# Altium project Controller_Board.PrjPcb
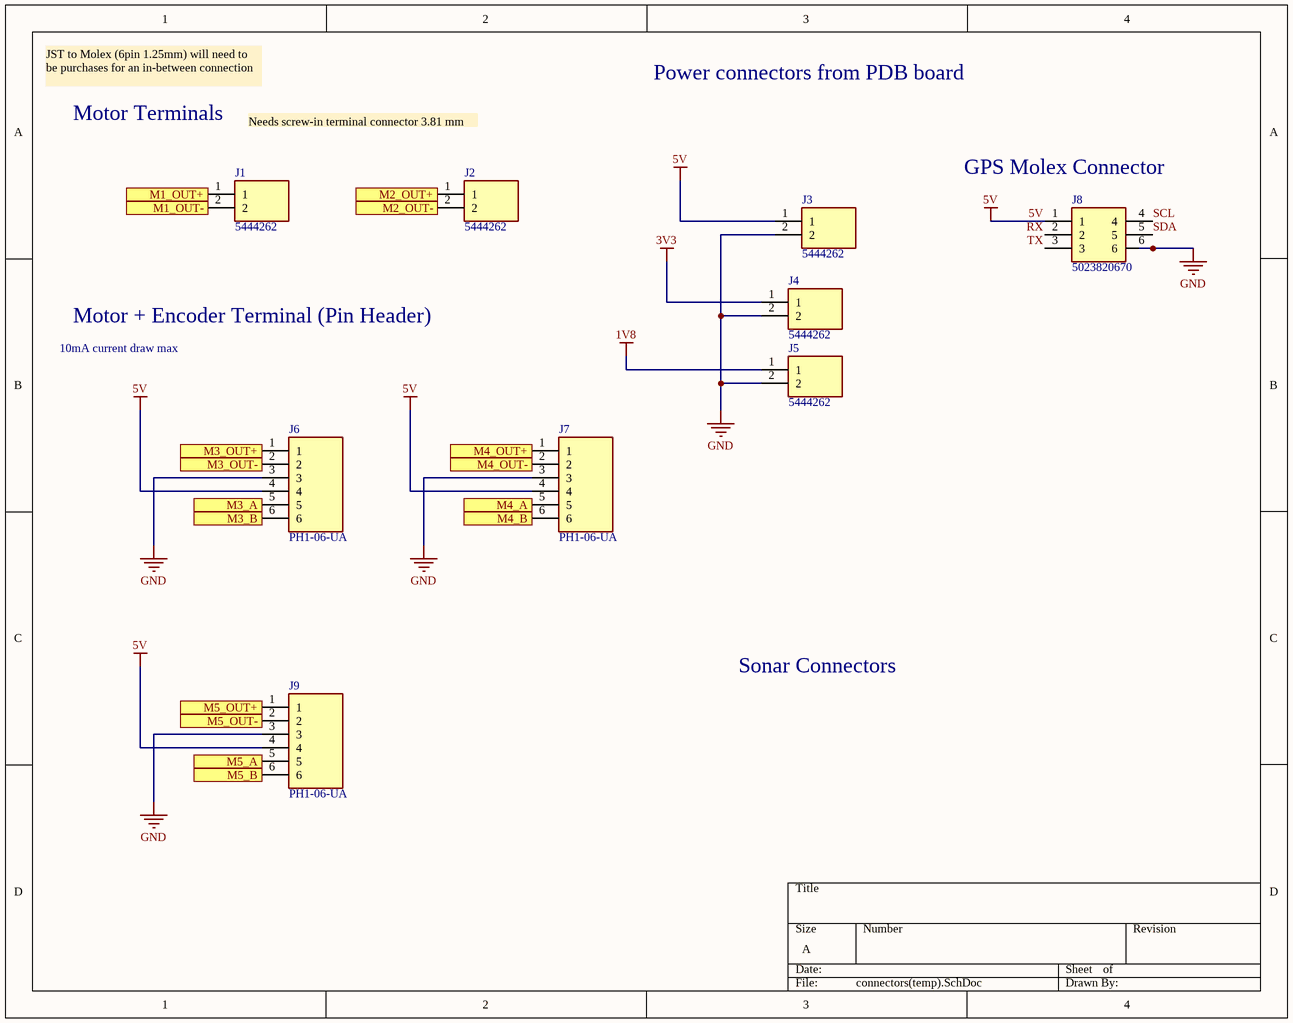
[diagram p0: connectors(temp).SchDoc]
CAGE_CODE: ?????; CONTRACT_NUMBER: <CONTRACT NO>; DOC_NO_ASSY_DWG: <ASSY DWG NO>; DOC_NO_BOM: <BOM DOC NO>; DOC_NO_FAB_DWG: <FAB DWG NO>; DOC_NO_SCH_DWG: <SCH DWG NO>; PCB_2_DEC_TOL: +/-.01; PCB_3_DEC_TOL: +/-.010; PCB_ANG_TOL: +/-1/2; PCB_ASSEMBLY_NO: <PCB ASSY NO>; PCB_CHECKER: - -----; PCB_CHECKER_APP_DATE: --/--/----; PCB_DESIGNER: - -----; PCB_DESIGNER_APP_DATE: --/--/----; PCB_DWG_NO: <PCB DWG NO>; PCB_ENGINEER: - -----; PCB_ENGINEER_APP_DATE: --/--/----; PCB_PART_NUMBER: <PCB PN>; PCB_REV: A; SCH_REV: A
5 sheets, 70 parts. Net scope: global (net labels, ports and power ports of the same name join across sheets).
Board file: Controller_PCB.PcbDoc
Sheets:
  connectors(temp).SchDoc
  IMU_sensors.SchDoc
  Controller.SchDoc
  Motor_Drivers.SchDoc
  Block Diagram.SchDoc

## Sheet connectors(temp).SchDoc
size A; SheetNumber: 1; SheetTotal: 4

### Parts
J1  5444262  [SHDR2W80P0X381_1X2_901X920X740P]
J2  5444262  [SHDR2W80P0X381_1X2_901X920X740P]
J3  5444262  [SHDR2W80P0X381_1X2_901X920X740P]
J4  5444262  [SHDR2W80P0X381_1X2_901X920X740P]
J5  5444262  [SHDR2W80P0X381_1X2_901X920X740P]
J6  PH1-06-UA  [HDRV6W64P0X254_1X6_1524X250X952P]
J7  PH1-06-UA  [HDRV6W64P0X254_1X6_1524X250X952P]
J8  5023820670  [5023820670]
J9  PH1-06-UA  [HDRV6W64P0X254_1X6_1524X250X952P]

### Ports
M1_OUT+ (in), M1_OUT- (in), M2_OUT+ (in), M2_OUT- (in), M3_A (out), M3_B (out), M3_OUT+ (in), M3_OUT- (in), M4_A (out), M4_B (out), M4_OUT+ (in), M4_OUT- (in), M5_A (out), M5_B (out), M5_OUT+ (in), M5_OUT- (in)

### Nets
1V8: J5.1
3V3: J4.1
5V: J3.1 J6.4 J7.4 J8.1 J9.4
GND: J3.2 J4.2 J5.2 J6.3 J7.3 J8.6 J9.3
M1_OUT+: J1.1 ; port M1_OUT+
M1_OUT-: J1.2 ; port M1_OUT-
M2_OUT+: J2.1 ; port M2_OUT+
M2_OUT-: J2.2 ; port M2_OUT-
M3_A: J6.5 ; port M3_A
M3_B: J6.6 ; port M3_B
M3_OUT+: J6.1 ; port M3_OUT+
M3_OUT-: J6.2 ; port M3_OUT-
M4_A: J7.5 ; port M4_A
M4_B: J7.6 ; port M4_B
M4_OUT+: J7.1 ; port M4_OUT+
M4_OUT-: J7.2 ; port M4_OUT-
M5_A: J9.5 ; port M5_A
M5_B: J9.6 ; port M5_B
M5_OUT+: J9.1 ; port M5_OUT+
M5_OUT-: J9.2 ; port M5_OUT-
RX: J8.2
SCL: J8.4
SDA: J8.5
TX: J8.3

### Notes on the sheet
- JST to Molex (6pin 1.25mm) will need to be purchases for an in-between connection
- Power connectors from PDB board
- Motor Terminals
- Needs screw-in terminal connector 3.81 mm connector
- (near J8) GPS Molex Connector
- 10mA current draw max
- Motor + Encoder Terminal (Pin Header)
- Sonar Connectors

### Library data of the parts
J1-J5 = 5444262: Connector; Manufacturer_Name: Phoenix Contact; Datasheet Link: https://datasheet.datasheetarchive.com/originals/distributors/Datasheets-DGA25/1829481.pdf; Height: 7.4mm; Manufacturer_Part_Number: 5444262; Mouser Part Number: 651-5444262; Mouser Price/Stock: https://www.mouser.co.uk/ProductDetail/Phoenix-Contact/5444262?qs=9Y9qB%2FCsC3lS%2FxAVKTDcmQ%3D%3D; Arrow Part Number: 5444262; Arrow Price/Stock: https://www.arrow.com/en/products/5444262/phoenix-contact?region=nac
J6 J7 J9 = PH1-06-UA: Connector; Manufacturer_Name: Adam Tech; Datasheet Link: https://datasheet.datasheetarchive.com/originals/distributors/Datasheets_SAMA/22522227e000bb8d8f26a3580c1bb98b.pdf; Height: 9.516mm; Manufacturer_Part_Number: PH1-06-UA; Arrow Part Number: PH1-06-UA; Arrow Price/Stock: https://www.arrow.com/en/products/ph1-06-ua/adam-tech?region=nac
J8 = 5023820670: Connector; Manufacturer_Name: Molex; Datasheet Link: https://www.molex.com/pdm_docs/sd/5023820870_sd.pdf; Height: 4.55mm; Manufacturer_Part_Number: 5023820670; Arrow Part Number: 5023820670; Arrow Price/Stock: https://www.arrow.com/en/products/502382-0670/molex

## Sheet IMU_sensors.SchDoc
size 431 x 279 mm; SheetNumber: 2; SheetTotal: 4
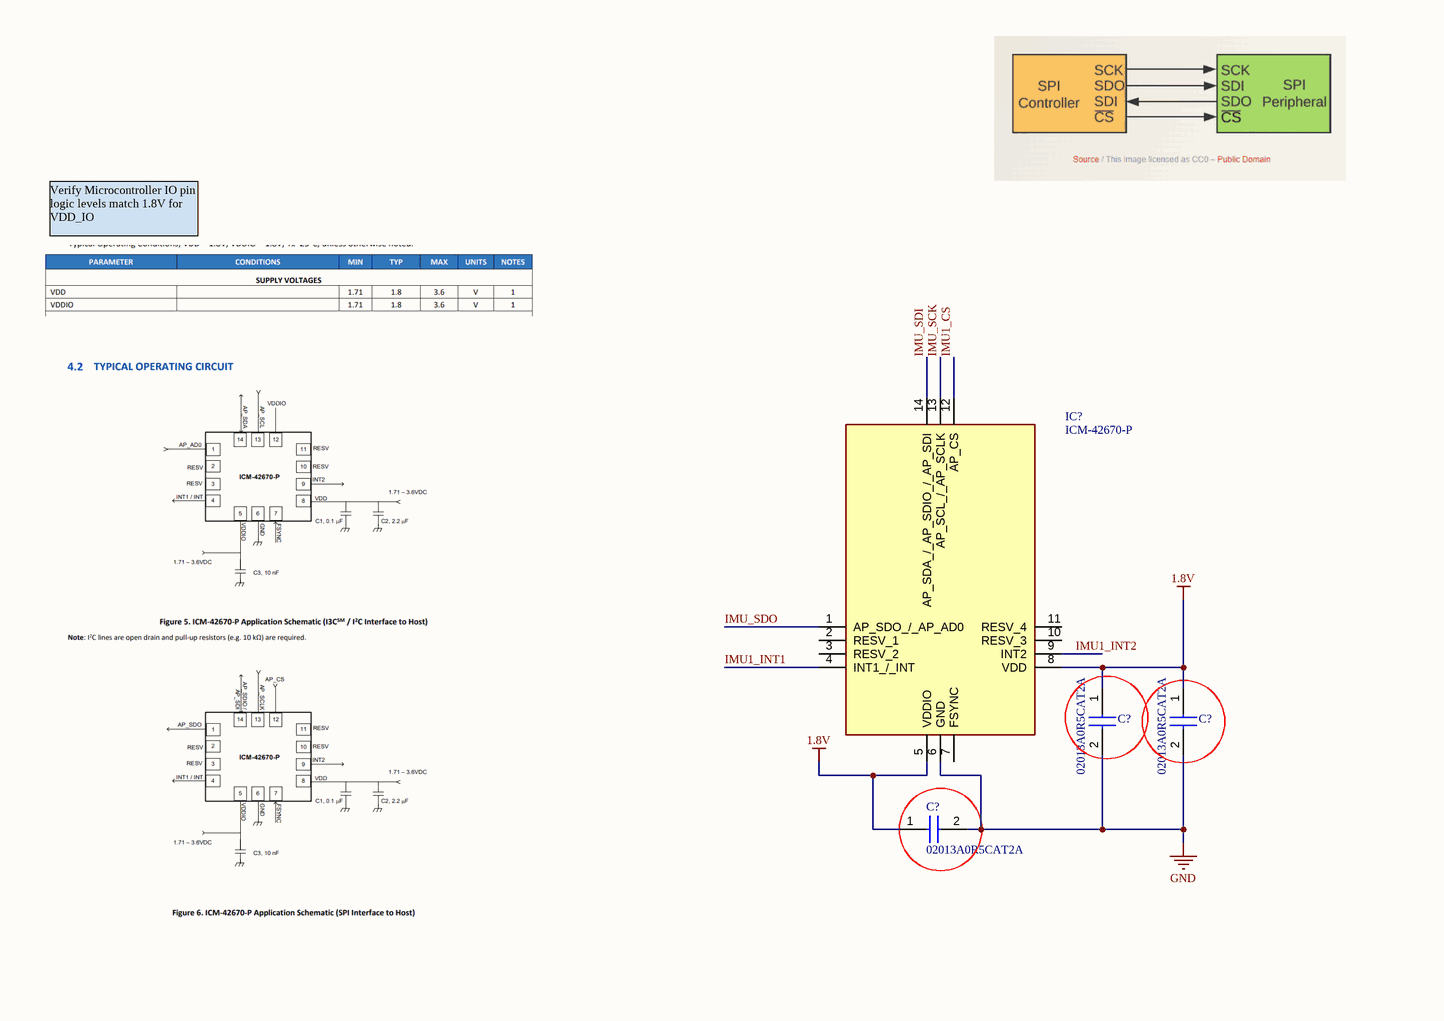
[diagram p1: IMU_sensors.SchDoc, left]
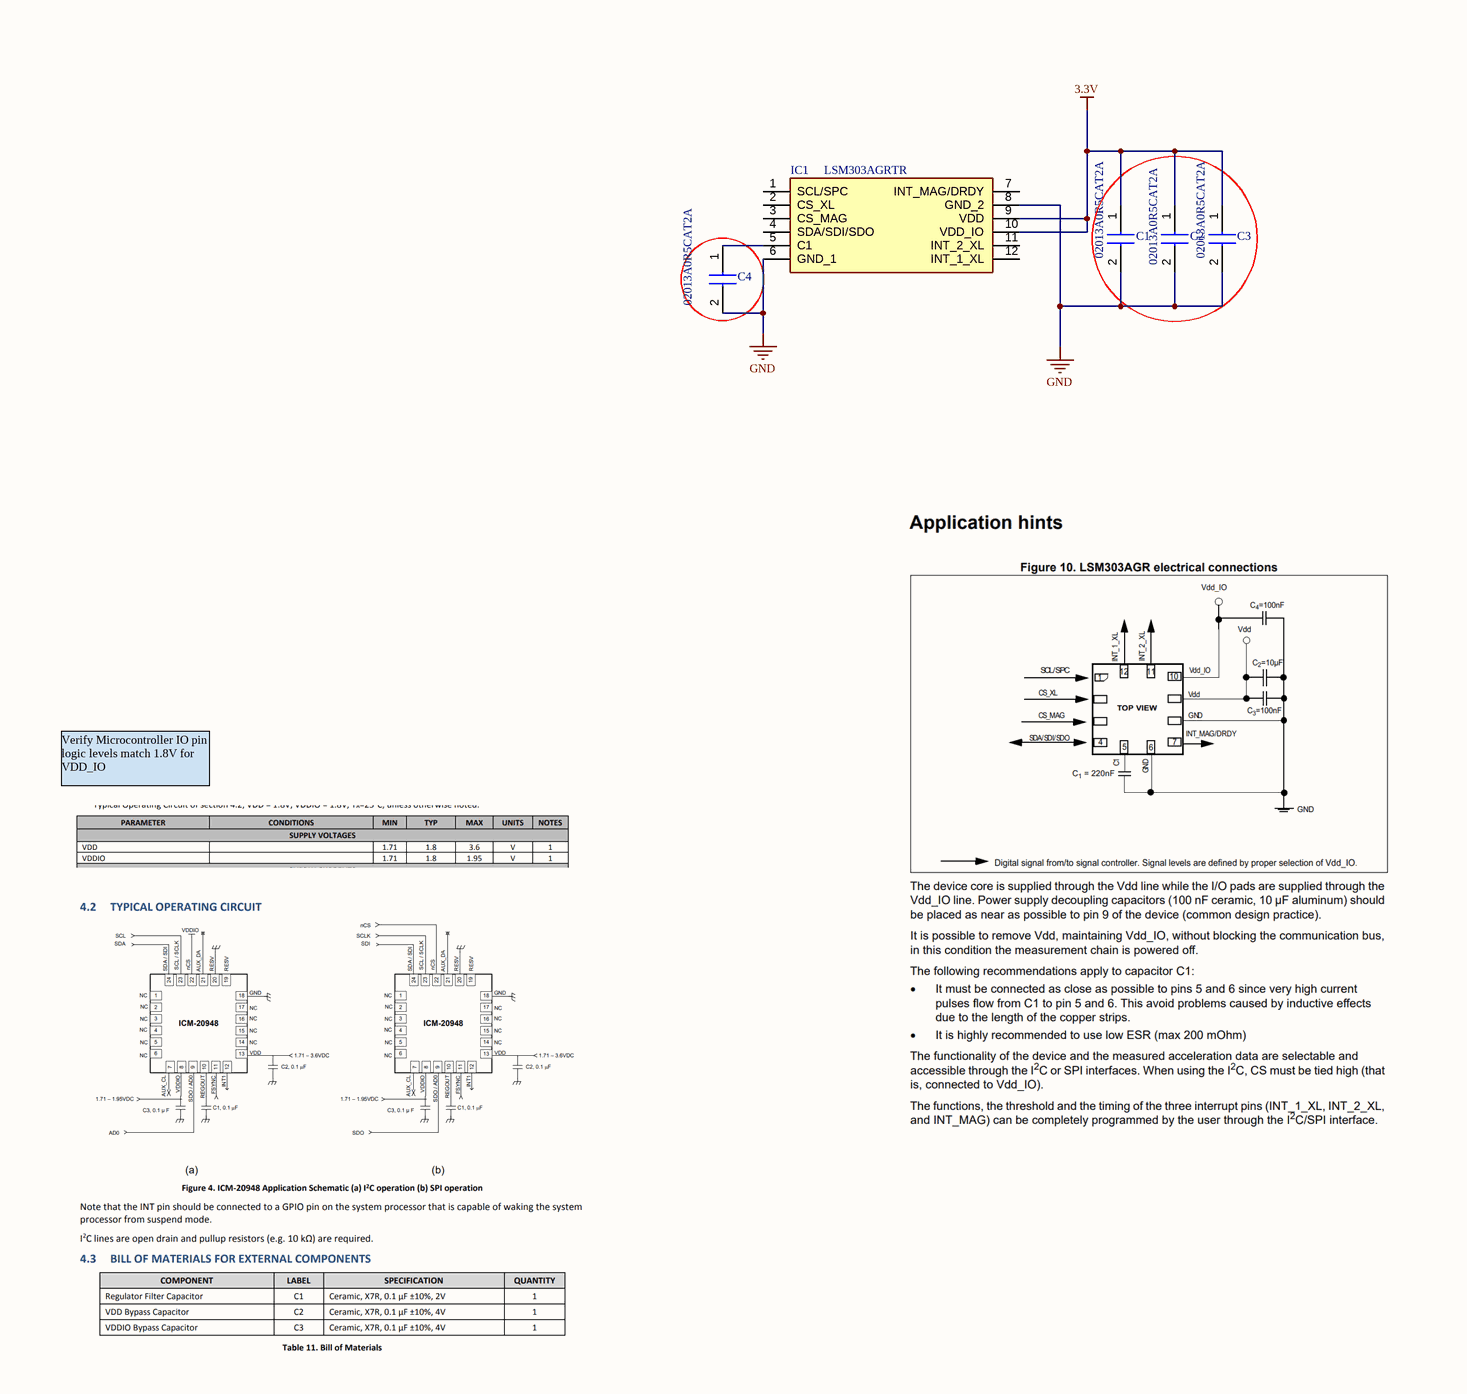
[diagram p2: IMU_sensors.SchDoc, right]

### Parts
(Parts that share a designator on the sheet are numbered #1, #2 ... from top to bottom, then left to right.)
C1  02013A0R5CAT2A  [CAPC0603X33N]
C2  02013A0R5CAT2A  [CAPC0603X33N]
C3  02013A0R5CAT2A  [CAPC0603X33N]
C4  02013A0R5CAT2A  [CAPC0603X33N]
C?#1  02013A0R5CAT2A  [CAPC0603X33N]
C?#2  02013A0R5CAT2A  [CAPC0603X33N]
C?#3  02013A0R5CAT2A  [CAPC0603X33N]
IC1  LSM303AGRTR  [LGA-12]
IC?  ICM-42670-P  [ICM42670P]

### Nets
1.8V: C?#1.1 C?#2.1 C?#3.1 IC?.5(VDDIO) IC?.8(VDD)
3.3V: C1.1 C2.1 C3.1 IC1.9(VDD) IC1.10(VDD_IO)
GND: C1.2 C2.2 C3.2 C4.2 C?#1.2 C?#2.2 C?#3.2 IC1.6(GND_1) IC1.8(GND_2) IC?.6(GND)
IMU1_CS: IC?.12(AP_CS)
IMU1_INT1: IC?.4(INT1_/_INT)
IMU1_INT2: IC?.9(INT2)
IMU_SCK: IC?.13(AP_SCL_/_AP_SCLK)
IMU_SDI: IC?.14(AP_SDA_/_AP_SDIO_/_AP_SDI)
IMU_SDO: IC?.1(AP_SDO_/_AP_AD0)
NetC4_1: C4.1 IC1.5(C1)

Not connected (* = marked no-connect by the designer): IC1 1(SCL/SPC) 2(CS_XL) 3(CS_MAG) 4(SDA/SDI/SDO) 7(INT_MAG/DRDY) 11(INT_2_XL) 12(INT_1_XL); IC? 2(RESV_1) 3(RESV_2) 7(FSYNC) 10(RESV_3) 11(RESV_4)

### Notes on the sheet
- Verify Microcontroller IO pin logic levels match 1.8V for VDD_IO
  1.8V Source also going to be needed. (Voltage divider or entirely seperate LDO
- DWG. NO.
- REV.
- SHT.
- THIS DOCUMENT AND THE DATA DISCLOSED HEREIN OR HEREWITH IS THE PROPERTY OF ALTIUM LIMITED AND MAY BE FREELY DISTRIBUTED IN WHOLE. NO RIGHTS ARE RESERVED OR EXPRESS OR IMPLIED WARANTEE GIVEN.
- REVISION
- DESCRIPTION
- DATE
- APPROVED
- ENG:
- APPROVALS
- PROJECT
- DSN:
- CHK:
- REFERENCE DOCUMENTS
- PROJECT REVISION:
- TITLE
- DOCUMENT REVISION:
- DESIGN ITEM:
- BOM:
- FAB DWG:
- PCB DWG:
- ASSY DWG:
- SCALE:
- SIZE
- B
- CAGE CODE
- FILE NAME
- DWG NO.
- SHEET
- OF
- REV

### Library data of the parts
C1-C4 C?#1-C?#3 = 02013A0R5CAT2A: Capacitor; Manufacturer_Name: AVX; Datasheet Link: http://www.mouser.com/catalog/supplier/library/pdf/AVXSurfaceMountCeramic.pdf; Height: 0.33mm; Manufacturer_Part_Number: 02013A0R5CAT2A; Mouser Part Number: 581-02013A0R5C; Mouser Price/Stock: https://www.mouser.co.uk/ProductDetail/AVX/02013A0R5CAT2A?qs=Thry1QCnmXB3nXCuXCgVMw%3D%3D; Arrow Part Number: 02013A0R5CAT2A; Arrow Price/Stock: https://www.arrow.com/en/products/02013a0r5cat2a/avx
IC1 = LSM303AGRTR: Integrated Circuit; Manufacturer_Name: STMicroelectronics; Datasheet Link: http://www.st.com/content/ccc/resource/technical/document/datasheet/74/c4/19/54/62/c5/46/13/DM00177685.pdf/files/DM00177685.pdf/jcr:content/translations/en.DM00177685.pdf; Manufacturer_Part_Number: LSM303AGRTR; Mouser Part Number: 511-LSM303AGRTR; Mouser Price/Stock: https://www.mouser.co.uk/ProductDetail/STMicroelectronics/LSM303AGRTR?qs=dTJS0cRn7oj2TlQhcroMCw%3D%3D; Arrow Part Number: LSM303AGRTR; Arrow Price/Stock: https://www.arrow.com/en/products/lsm303agrtr/stmicroelectronics?region=nac
IC? = ICM-42670-P: Integrated Circuit; Manufacturer_Name: TDK; Datasheet Link: https://3cfeqx1hf82y3xcoull08ihx-wpengine.netdna-ssl.com/wp-content/uploads/2021/07/DS-000451-ICM-42670-P-v1.0.pdf; Manufacturer_Part_Number: ICM-42670-P; Mouser Part Number: 410-ICM-42670-P; Mouser Price/Stock: https://www.mouser.co.uk/ProductDetail/TDK-InvenSense/ICM-42670-P?qs=iLbezkQI%252BsgK8sMF5V7fQQ%3D%3D; Arrow Part Number: ICM-42670-P; Arrow Price/Stock: https://www.arrow.com/en/products/icm-42670-p/invensense?region=nac

## Sheet Controller.SchDoc
size B; ENG_APP_DATE: --/--/--; DSN_APP_DATE: --/--/--; CHK_APP_DATE: --/--/--; Organization: My Company; Address1: Address Line 1; Address2: Address Line 2; Address3: Address Line 3; Address4: Address Line 4; SheetNumber: 3; SheetTotal: 5
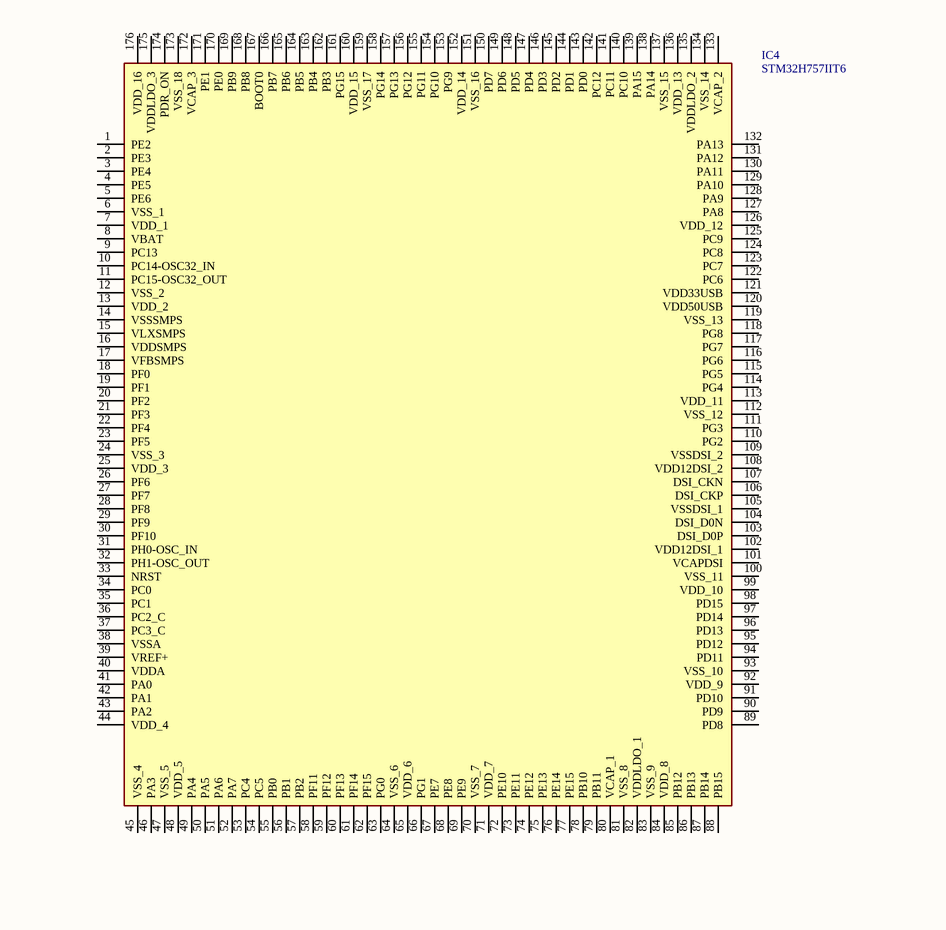
[diagram p3: Controller.SchDoc, top]
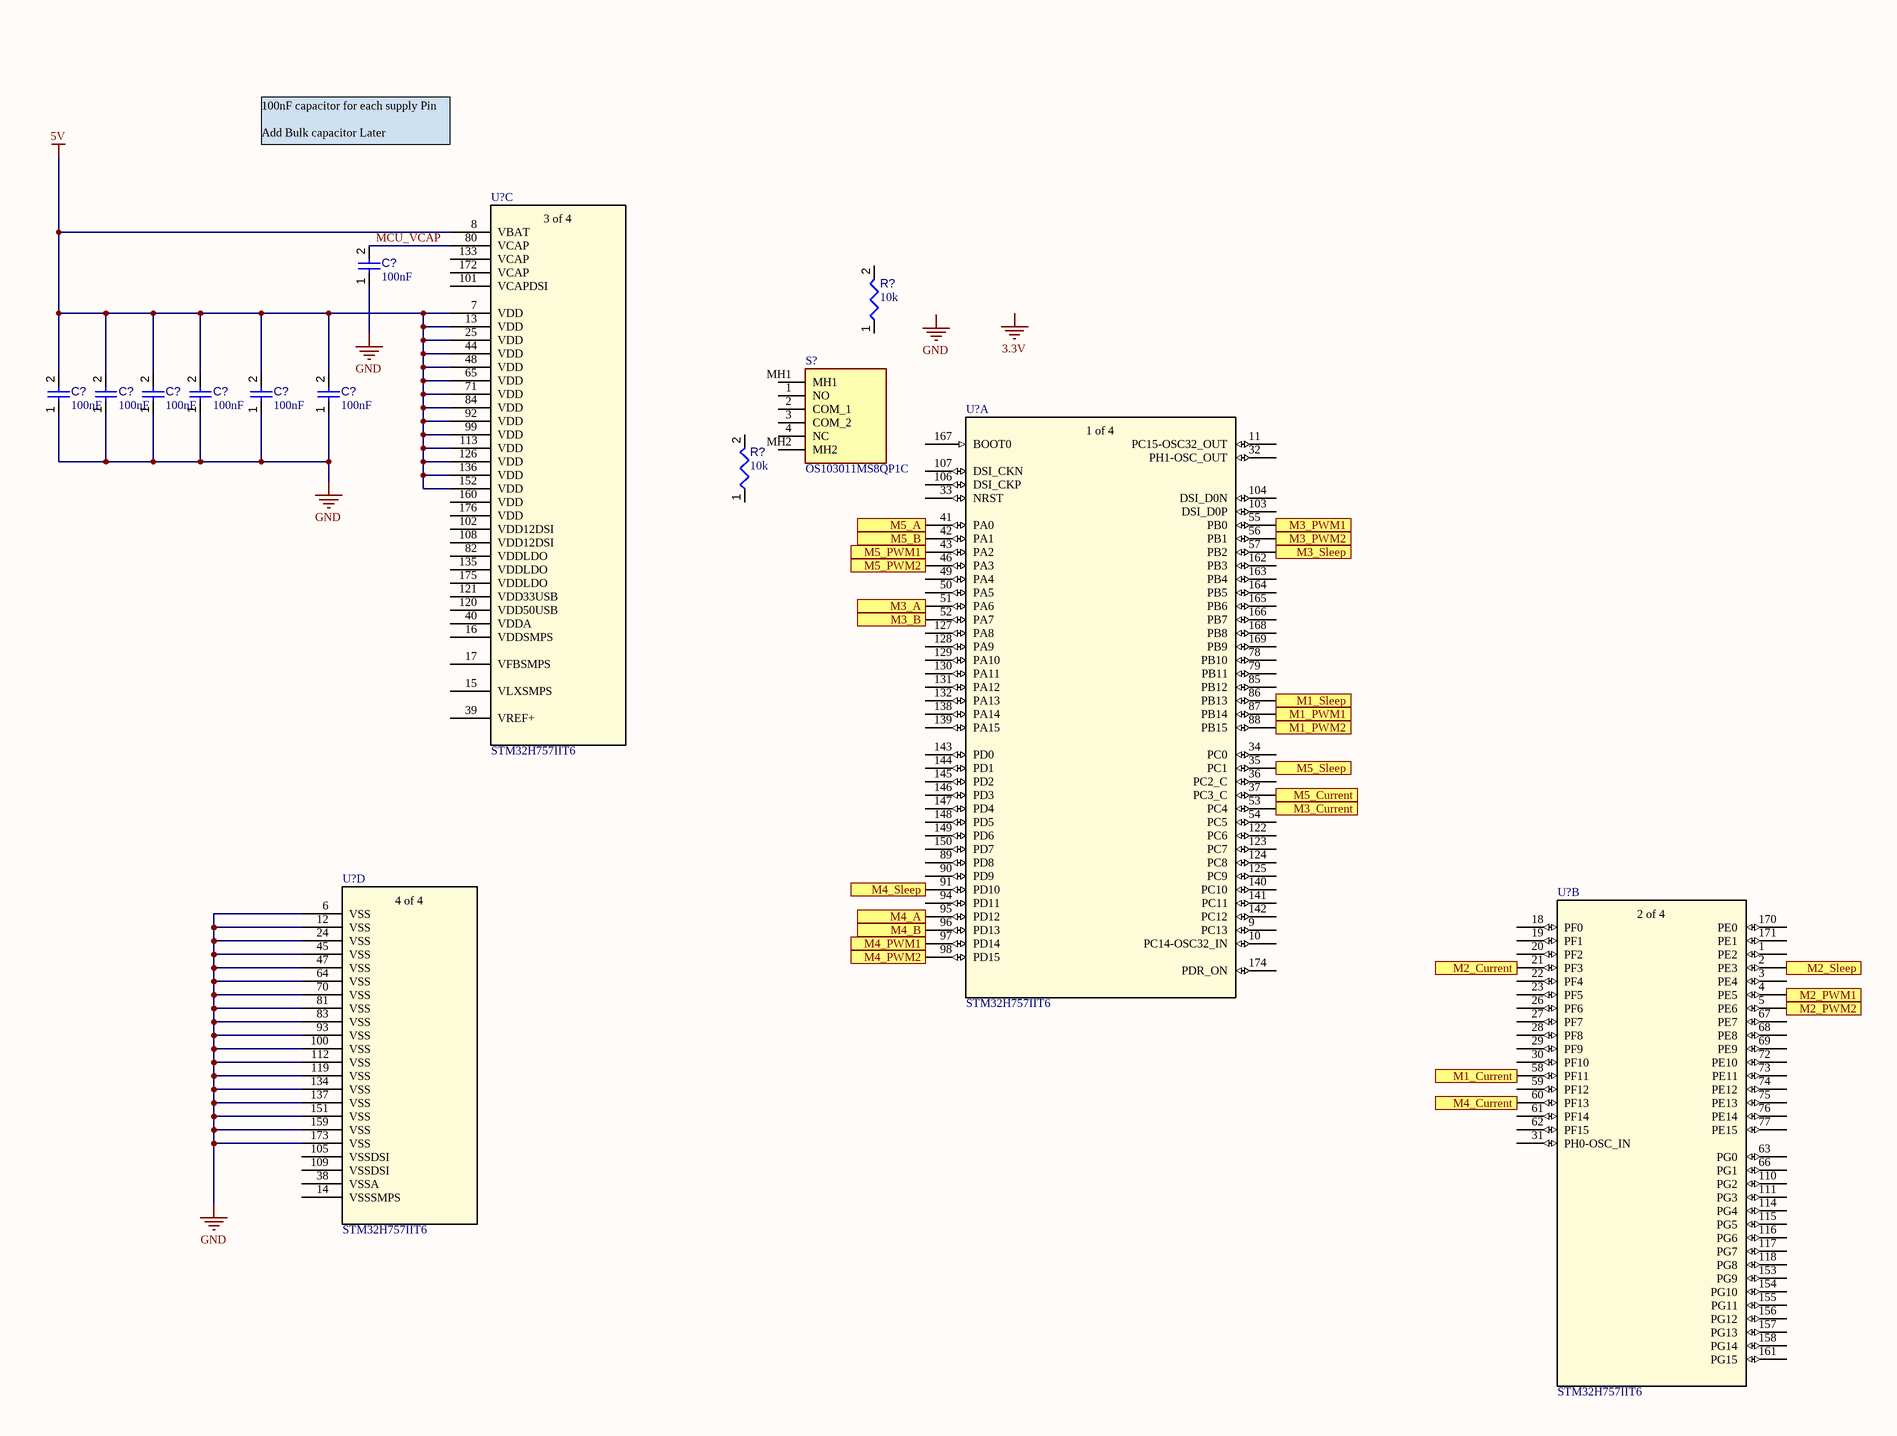
[diagram p4: Controller.SchDoc, bottom]

### Parts
(Parts that share a designator on the sheet are numbered #1, #2 ... from top to bottom, then left to right.)
C?#4  value 100nF  [CAPC2013X95X50LL10T25]  (hidden comment: Capacitor 100 nF +/-10% 50 V 0805)
C?#5  value 100nF  [CAPC2013X95X50LL10T25]  (hidden comment: Capacitor 100 nF +/-10% 50 V 0805)
C?#6  value 100nF  [CAPC2013X95X50LL10T25]  (hidden comment: Capacitor 100 nF +/-10% 50 V 0805)
C?#7  value 100nF  [CAPC2013X95X50LL10T25]  (hidden comment: Capacitor 100 nF +/-10% 50 V 0805)
C?#8  value 100nF  [CAPC2013X95X50LL10T25]  (hidden comment: Capacitor 100 nF +/-10% 50 V 0805)
C?#9  value 100nF  [CAPC2013X95X50LL10T25]  (hidden comment: Capacitor 100 nF +/-10% 50 V 0805)
C?#10  value 100nF  [CAPC2013X95X50LL10T25]  (hidden comment: Capacitor 100 nF +/-10% 50 V 0805)
IC4  STM32H757IIT6  [QFP50P2600X2600X160-176N]
R?#1  value 10k  [RESC3216X60X45ML15T20]  (hidden comment: Resistor 10k +/-1% 1206 250 mW)
R?#2  value 10k  [RESC3216X60X45ML15T20]  (hidden comment: Resistor 10k +/-1% 1206 250 mW)
S?  OS103011MS8QP1C  [OS103011MS8QP1C]
U?#1  STM32H757IIT6  [LQFP-176]  (part C of 4)
U?#2  STM32H757IIT6  [LQFP-176]  (part A of 4)
U?#3  STM32H757IIT6  [LQFP-176]  (part D of 4)
U?#4  STM32H757IIT6  [LQFP-176]  (part B of 4)

### Ports
M1_Current (in), M1_PWM1 (out), M1_PWM2 (out), M1_Sleep (out), M2_Current (in), M2_PWM1 (out), M2_PWM2 (out), M2_Sleep (out), M3_A (in), M3_B (in), M3_Current (in), M3_PWM1 (out), M3_PWM2 (out), M3_Sleep (out), M4_A (in), M4_B (in), M4_Current (in), M4_PWM1 (out), M4_PWM2 (out), M4_Sleep (out), M5_A (in), M5_B (in), M5_Current (in), M5_PWM1 (out), M5_PWM2 (out), M5_Sleep (out)

### Nets
5V: C?#5.2 C?#6.2 C?#7.2 C?#8.2 C?#9.2 C?#10.2 U?#1.7(VDD) U?#1.8(VBAT) U?#1.13(VDD) U?#1.25(VDD) U?#1.44(VDD) U?#1.48(VDD) U?#1.65(VDD) U?#1.71(VDD) U?#1.84(VDD) U?#1.92(VDD) U?#1.99(VDD) U?#1.113(VDD) U?#1.126(VDD) U?#1.136(VDD) U?#1.152(VDD)
GND: C?#4.1 C?#5.1 C?#6.1 C?#7.1 C?#8.1 C?#9.1 C?#10.1 U?#3.6(VSS) U?#3.12(VSS) U?#3.24(VSS) U?#3.45(VSS) U?#3.47(VSS) U?#3.64(VSS) U?#3.70(VSS) U?#3.81(VSS) U?#3.83(VSS) U?#3.93(VSS) U?#3.100(VSS) U?#3.112(VSS) U?#3.119(VSS) U?#3.134(VSS) U?#3.137(VSS) U?#3.151(VSS) U?#3.159(VSS) U?#3.173(VSS)
M1_Current: U?#4.58(PF11) ; port M1_Current
M1_PWM1: U?#2.87(PB14) ; port M1_PWM1
M1_PWM2: U?#2.88(PB15) ; port M1_PWM2
M1_Sleep: U?#2.86(PB13) ; port M1_Sleep
M2_Current: U?#4.21(PF3) ; port M2_Current
M2_PWM1: U?#4.4(PE5) ; port M2_PWM1
M2_PWM2: U?#4.5(PE6) ; port M2_PWM2
M2_Sleep: U?#4.2(PE3) ; port M2_Sleep
M3_A: U?#2.51(PA6) ; port M3_A
M3_B: U?#2.52(PA7) ; port M3_B
M3_Current: U?#2.53(PC4) ; port M3_Current
M3_PWM1: U?#2.55(PB0) ; port M3_PWM1
M3_PWM2: U?#2.56(PB1) ; port M3_PWM2
M3_Sleep: U?#2.57(PB2) ; port M3_Sleep
M4_A: U?#2.95(PD12) ; port M4_A
M4_B: U?#2.96(PD13) ; port M4_B
M4_Current: U?#4.60(PF13) ; port M4_Current
M4_PWM1: U?#2.97(PD14) ; port M4_PWM1
M4_PWM2: U?#2.98(PD15) ; port M4_PWM2
M4_Sleep: U?#2.91(PD10) ; port M4_Sleep
M5_A: U?#2.41(PA0) ; port M5_A
M5_B: U?#2.42(PA1) ; port M5_B
M5_Current: U?#2.37(PC3_C) ; port M5_Current
M5_PWM1: U?#2.43(PA2) ; port M5_PWM1
M5_PWM2: U?#2.46(PA3) ; port M5_PWM2
M5_Sleep: U?#2.35(PC1) ; port M5_Sleep
MCU_VCAP: C?#4.2 U?#1.80(VCAP)

Not connected (* = marked no-connect by the designer): IC4 1(PE2) 2(PE3) 3(PE4) 4(PE5) 5(PE6) 6(VSS_1) 7(VDD_1) 8(VBAT) 9(PC13) 10(PC14-OSC32_IN) 11(PC15-OSC32_OUT) 12(VSS_2) 13(VDD_2) 14(VSSSMPS) 15(VLXSMPS) 16(VDDSMPS) 17(VFBSMPS) 18(PF0) 19(PF1) 20(PF2) 21(PF3) 22(PF4) 23(PF5) 24(VSS_3) 25(VDD_3) 26(PF6) 27(PF7) 28(PF8) 29(PF9) 30(PF10) 31(PH0-OSC_IN) 32(PH1-OSC_OUT) 33(NRST) 34(PC0) 35(PC1) 36(PC2_C) 37(PC3_C) 38(VSSA) 39(VREF+) 40(VDDA) 41(PA0) 42(PA1) 43(PA2) 44(VDD_4) 45(VSS_4) 46(PA3) 47(VSS_5) 48(VDD_5) 49(PA4) 50(PA5) 51(PA6) 52(PA7) 53(PC4) 54(PC5) 55(PB0) 56(PB1) 57(PB2) 58(PF11) 59(PF12) 60(PF13) 61(PF14) 62(PF15) 63(PG0) 64(VSS_6) 65(VDD_6) 66(PG1) 67(PE7) 68(PE8) 69(PE9) 70(VSS_7) 71(VDD_7) 72(PE10) 73(PE11) 74(PE12) 75(PE13) 76(PE14) 77(PE15) 78(PB10) 79(PB11) 80(VCAP_1) 81(VSS_8) 82(VDDLDO_1) 83(VSS_9) 84(VDD_8) 85(PB12) 86(PB13) 87(PB14) 88(PB15) 89(PD8) 90(PD9) 91(PD10) 92(VDD_9) 93(VSS_10) 94(PD11) 95(PD12) 96(PD13) 97(PD14) 98(PD15) 99(VDD_10) 100(VSS_11) 101(VCAPDSI) 102(VDD12DSI_1) 103(DSI_D0P) 104(DSI_D0N) 105(VSSDSI_1) 106(DSI_CKP) 107(DSI_CKN) 108(VDD12DSI_2) 109(VSSDSI_2) 110(PG2) 111(PG3) 112(VSS_12) 113(VDD_11) 114(PG4) 115(PG5) 116(PG6) 117(PG7) 118(PG8) 119(VSS_13) 120(VDD50USB) 121(VDD33USB) 122(PC6) 123(PC7) 124(PC8) 125(PC9) 126(VDD_12) 127(PA8) 128(PA9) 129(PA10) 130(PA11) 131(PA12) 132(PA13) 133(VCAP_2) 134(VSS_14) 135(VDDLDO_2) 136(VDD_13) 137(VSS_15) 138(PA14) 139(PA15) 140(PC10) 141(PC11) 142(PC12) 143(PD0) 144(PD1) 145(PD2) 146(PD3) 147(PD4) 148(PD5) 149(PD6) 150(PD7) 151(VSS_16) 152(VDD_14) 153(PG9) 154(PG10) 155(PG11) 156(PG12) 157(PG13) 158(PG14) 159(VSS_17) 160(VDD_15) 161(PG15) 162(PB3) 163(PB4) 164(PB5) 165(PB6) 166(PB7) 167(BOOT0) 168(PB8) 169(PB9) 170(PE0) 171(PE1) 172(VCAP_3) 173(VSS_18) 174(PDR_ON) 175(VDDLDO_3) 176(VDD_16); R?#1 1 2; R?#2 1 2; S? 1(NO) 2(COM_1) 3(COM_2) 4(NC) MH1 MH2; U?#1 15(VLXSMPS) 16(VDDSMPS) 17(VFBSMPS) 39(VREF+) 40(VDDA) 82(VDDLDO) 101(VCAPDSI) 102(VDD12DSI) 108(VDD12DSI) 120(VDD50USB) 121(VDD33USB) 133(VCAP) 135(VDDLDO) 160(VDD) 172(VCAP) 175(VDDLDO) 176(VDD); U?#2 9(PC13) 10(PC14-OSC32_IN) 11(PC15-OSC32_OUT) 32(PH1-OSC_OUT) 33(NRST) 34(PC0) 36(PC2_C) 49(PA4) 50(PA5) 54(PC5) 78(PB10) 79(PB11) 85(PB12) 89(PD8) 90(PD9) 94(PD11) 103(DSI_D0P) 104(DSI_D0N) 106(DSI_CKP) 107(DSI_CKN) 122(PC6) 123(PC7) 124(PC8) 125(PC9) 127(PA8) 128(PA9) 129(PA10) 130(PA11) 131(PA12) 132(PA13) 138(PA14) 139(PA15) 140(PC10) 141(PC11) 142(PC12) 143(PD0) 144(PD1) 145(PD2) 146(PD3) 147(PD4) 148(PD5) 149(PD6) 150(PD7) 162(PB3) 163(PB4) 164(PB5) 165(PB6) 166(PB7) 167(BOOT0) 168(PB8) 169(PB9) 174(PDR_ON); U?#3 14(VSSSMPS) 38(VSSA) 105(VSSDSI) 109(VSSDSI); U?#4 1(PE2) 3(PE4) 18(PF0) 19(PF1) 20(PF2) 22(PF4) 23(PF5) 26(PF6) 27(PF7) 28(PF8) 29(PF9) 30(PF10) 31(PH0-OSC_IN) 59(PF12) 61(PF14) 62(PF15) 63(PG0) 66(PG1) 67(PE7) 68(PE8) 69(PE9) 72(PE10) 73(PE11) 74(PE12) 75(PE13) 76(PE14) 77(PE15) 110(PG2) 111(PG3) 114(PG4) 115(PG5) 116(PG6) 117(PG7) 118(PG8) 153(PG9) 154(PG10) 155(PG11) 156(PG12) 157(PG13) 158(PG14) 161(PG15) 170(PE0) 171(PE1)

### Notes on the sheet
- 100nF capacitor for each supply Pin
  Add Bulk capacitor Later
- Labels drawn without touching a wire or pin: 3.3V, GND
- Title:
- Size:
- Engineer:
- Revision:
- Date:
- B
- Time Edited:
- Sheet
- of
- File:
- (in symbol STM32H757IIT6, part A) 1 of 4
- (in symbol STM32H757IIT6, part B) 2 of 4
- (in symbol STM32H757IIT6, part C) 3 of 4
- (in symbol STM32H757IIT6, part D) 4 of 4

### Library data of the parts
C?#4-C?#10 = CMP-001-00018-6: Chip Capacitor, 100 nF, +/- 10%, 50 V, 0805 (2012 Metric); Capacitor Type: Ceramic; Voltage Rating: 50V; Pins: 2; Max Operating Temperature: 125°C; Min Operating Temperature: -55°C; Mounting Technology: SM; Case/Package: 0805; RoHS Compliant: True; Tolerance: 10%
IC4 = STM32H757IIT6: Integrated Circuit; Manufacturer_Name: STMicroelectronics; Datasheet Link: https://www.st.com/resource/en/datasheet/stm32h757ai.pdf; Height: 1.6mm; Manufacturer_Part_Number: STM32H757IIT6; Mouser Part Number: 511-STM32H757IIT6; Mouser Price/Stock: https://www.mouser.co.uk/ProductDetail/STMicroelectronics/STM32H757IIT6?qs=vLWxofP3U2wz9EzH5pjPxQ%3D%3D; Arrow Part Number: STM32H757IIT6; Arrow Price/Stock: https://www.arrow.com/en/products/stm32h757iit6/stmicroelectronics?region=nac
R?#1 R?#2 = CMP-009-00016-5: Chip Resistor, 10 KOhm, +/- 1%, 0.25 W, -55 to 155 degC, 1206 (3216 Metric); Power: 250mW; Voltage Rating: 200V; Pins: 2; Max Operating Temperature: 155°C; Tolerance: 1%; RoHS Compliant: True; Case/Package: 1206; Min Operating Temperature: -55°C; Mounting Technology: SM
S? = OS103011MS8QP1C: Switch; Manufacturer_Name: C & K COMPONENTS; Datasheet Link: https://www.mouser.com/datasheet/2/60/os-1382783.pdf; Height: 8.7mm; Manufacturer_Part_Number: OS103011MS8QP1C; Mouser Part Number: 611-OS103011MS8QP1C; Mouser Price/Stock: https://www.mouser.co.uk/ProductDetail/CK/OS103011MS8QP1C?qs=RHLK7eRW6AERXHXtlIQZ1Q%3D%3D; Arrow Part Number: OS103011MS8QP1C; Arrow Price/Stock: https://www.arrow.com/en/products/os103011ms8qp1c/ck?region=europe
U?#1-U?#4 = STM32H757IIT6: No Description Available; Mfr_Name: STMicroelectronics; RefDes: RefDes; Type: Type
  U?#2: ComponentLink1Description: Datasheet Link; ComponentLink1URL: https://www.st.com/resource/en/datasheet/stm32h757ai.pdf

## Sheet Motor_Drivers.SchDoc
size 431 x 279 mm; SheetNumber: 4; SheetTotal: 4
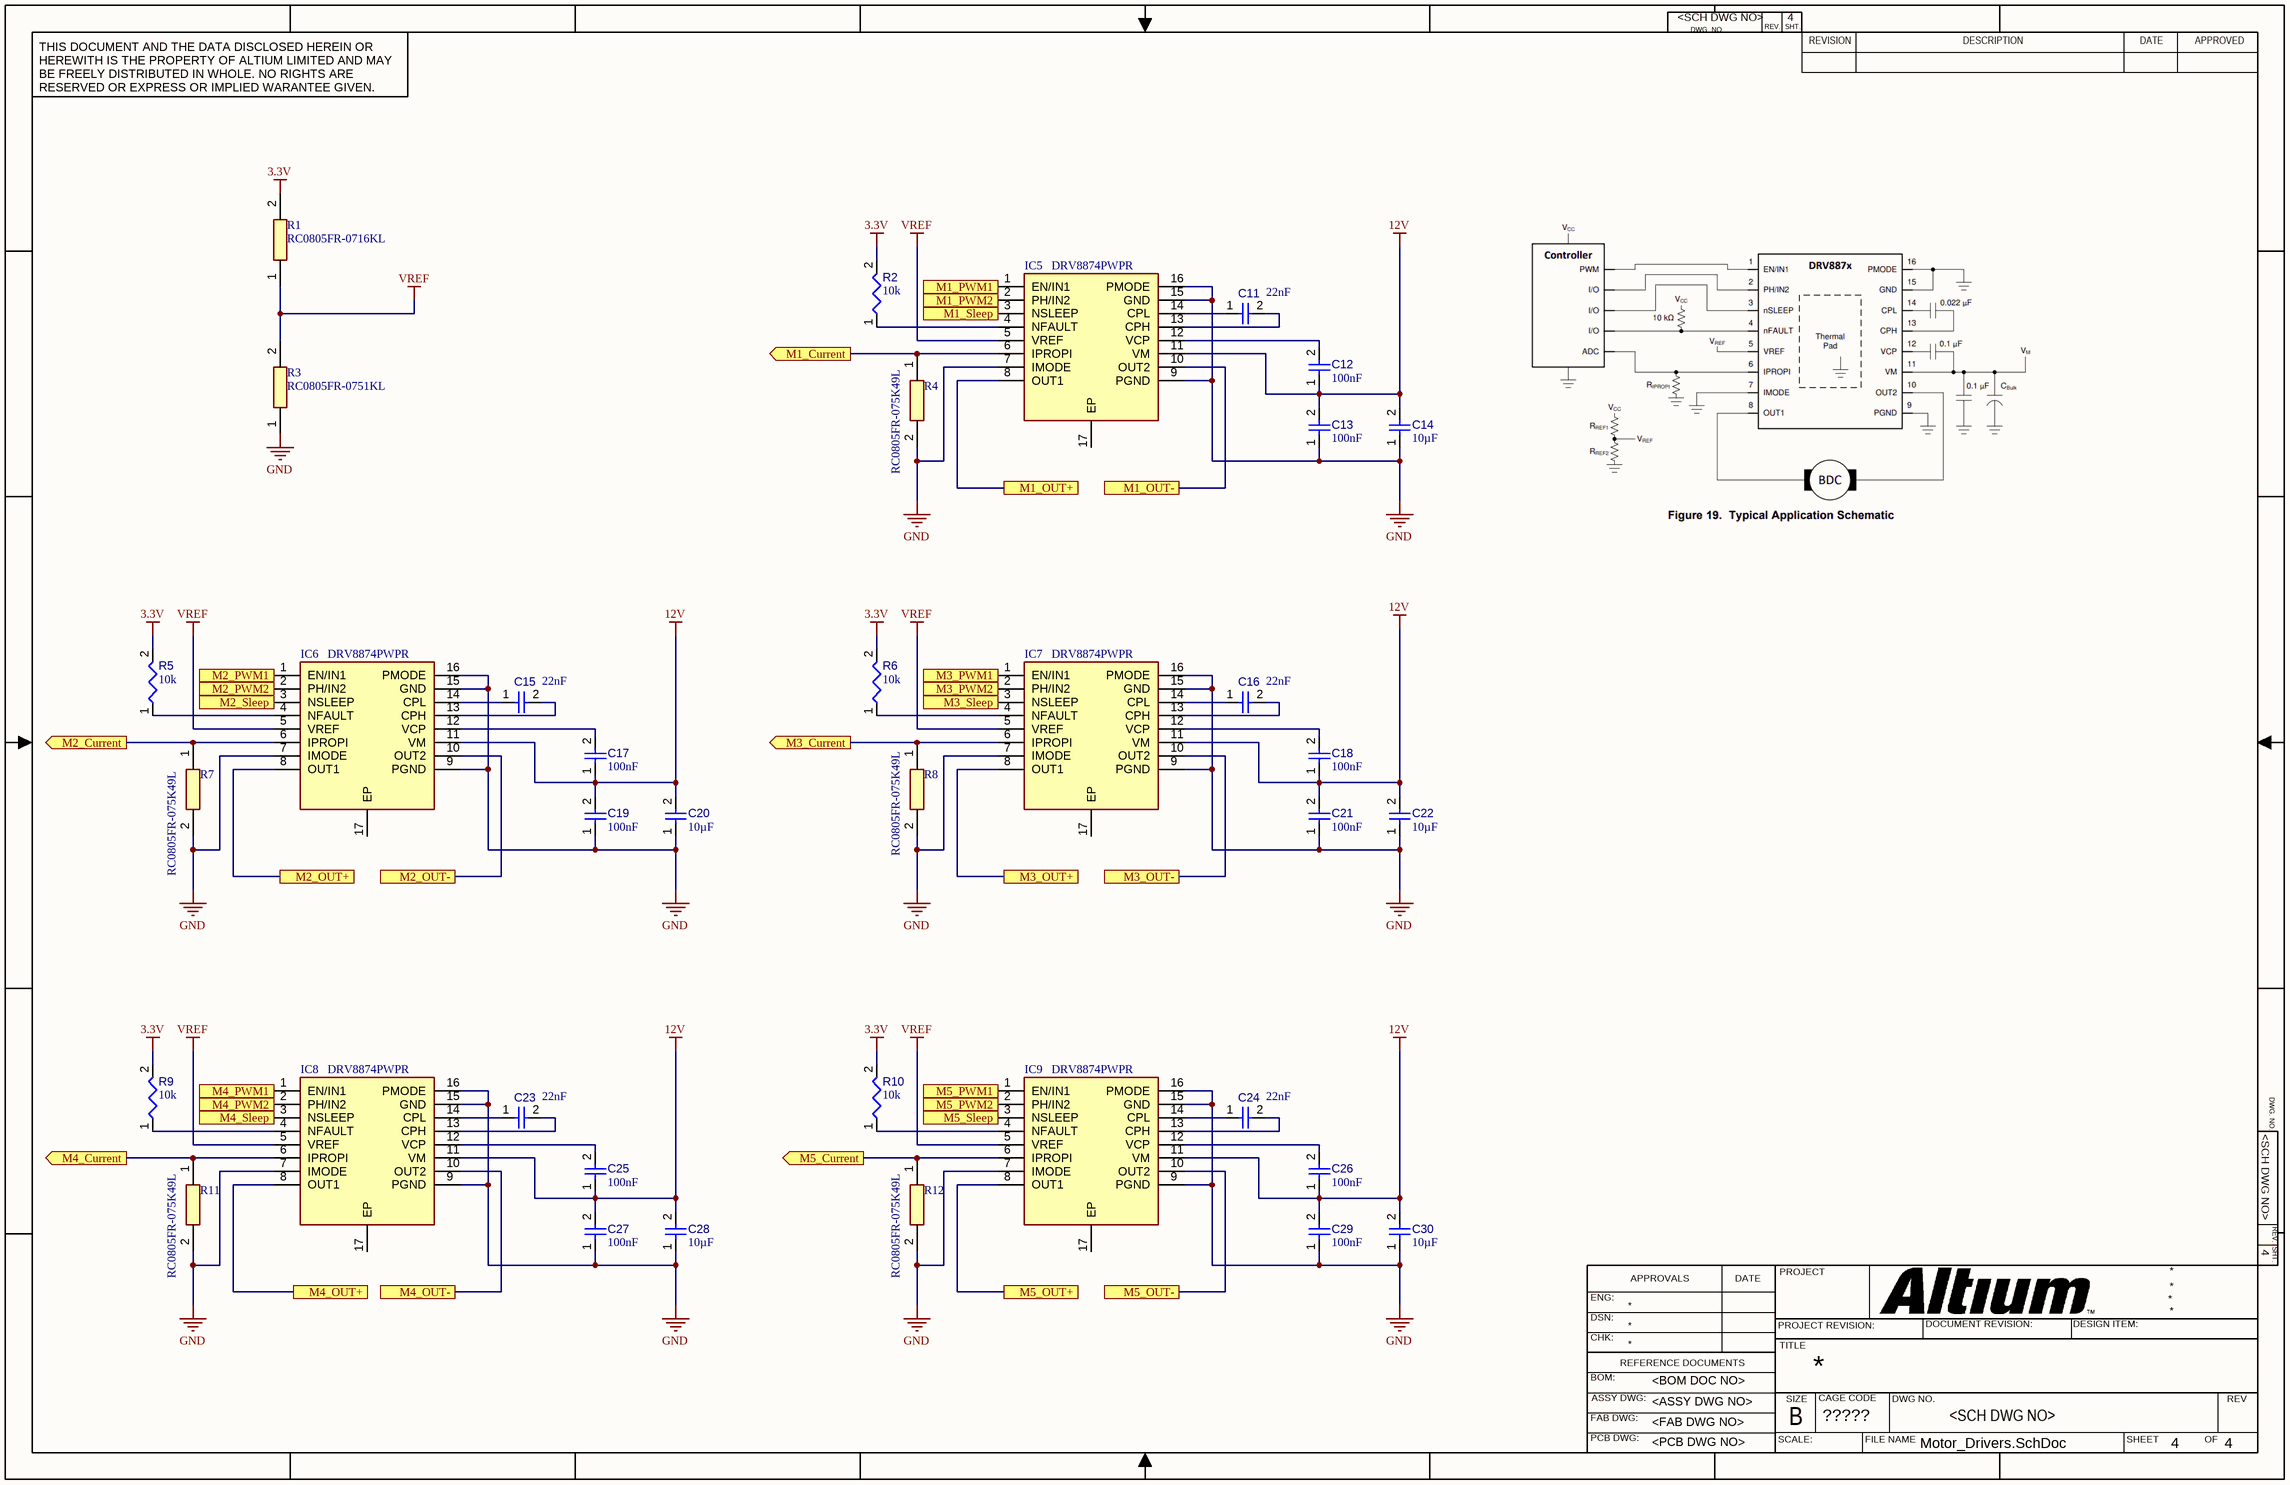
[diagram p5: Motor_Drivers.SchDoc]

### Parts
C11  value 22nF  [CAPC0402(1005)60_L]  (hidden comment: Capacitor 22nF +/-20% 10V 0402)
C12  value 100nF  [CAPC2013X95X50LL10T25]  (hidden comment: Capacitor 100 nF +/-10% 50 V 0805)
C13  value 100nF  [CAPC2013X95X50LL10T25]  (hidden comment: Capacitor 100 nF +/-10% 50 V 0805)
C14  value 10µF  [CAPC0805(2012)145_L]  (hidden comment: Capacitor 10µF +/-20% 25V 0805)
C15  value 22nF  [CAPC0402(1005)60_L]  (hidden comment: Capacitor 22nF +/-20% 10V 0402)
C16  value 22nF  [CAPC0402(1005)60_L]  (hidden comment: Capacitor 22nF +/-20% 10V 0402)
C17  value 100nF  [CAPC2013X95X50LL10T25]  (hidden comment: Capacitor 100 nF +/-10% 50 V 0805)
C18  value 100nF  [CAPC2013X95X50LL10T25]  (hidden comment: Capacitor 100 nF +/-10% 50 V 0805)
C19  value 100nF  [CAPC2013X95X50LL10T25]  (hidden comment: Capacitor 100 nF +/-10% 50 V 0805)
C20  value 10µF  [CAPC0805(2012)145_L]  (hidden comment: Capacitor 10µF +/-20% 25V 0805)
C21  value 100nF  [CAPC2013X95X50LL10T25]  (hidden comment: Capacitor 100 nF +/-10% 50 V 0805)
C22  value 10µF  [CAPC0805(2012)145_L]  (hidden comment: Capacitor 10µF +/-20% 25V 0805)
C23  value 22nF  [CAPC0402(1005)60_L]  (hidden comment: Capacitor 22nF +/-20% 10V 0402)
C24  value 22nF  [CAPC0402(1005)60_L]  (hidden comment: Capacitor 22nF +/-20% 10V 0402)
C25  value 100nF  [CAPC2013X95X50LL10T25]  (hidden comment: Capacitor 100 nF +/-10% 50 V 0805)
C26  value 100nF  [CAPC2013X95X50LL10T25]  (hidden comment: Capacitor 100 nF +/-10% 50 V 0805)
C27  value 100nF  [CAPC2013X95X50LL10T25]  (hidden comment: Capacitor 100 nF +/-10% 50 V 0805)
C28  value 10µF  [CAPC0805(2012)145_L]  (hidden comment: Capacitor 10µF +/-20% 25V 0805)
C29  value 100nF  [CAPC2013X95X50LL10T25]  (hidden comment: Capacitor 100 nF +/-10% 50 V 0805)
C30  value 10µF  [CAPC0805(2012)145_L]  (hidden comment: Capacitor 10µF +/-20% 25V 0805)
IC5  DRV8874PWPR  [SOP65P640X120-17N]
IC6  DRV8874PWPR  [SOP65P640X120-17N]
IC7  DRV8874PWPR  [SOP65P640X120-17N]
IC8  DRV8874PWPR  [SOP65P640X120-17N]
IC9  DRV8874PWPR  [SOP65P640X120-17N]
R1  RC0805FR-0716KL  [RESC2012X60N]
R2  value 10k  [RESC3216X60X45ML15T20]  (hidden comment: Resistor 10k +/-1% 1206 250 mW)
R3  RC0805FR-0751KL  [RESC2012X60N]
R4  RC0805FR-075K49L  [RESC2012X60N]
R5  value 10k  [RESC3216X60X45ML15T20]  (hidden comment: Resistor 10k +/-1% 1206 250 mW)
R6  value 10k  [RESC3216X60X45ML15T20]  (hidden comment: Resistor 10k +/-1% 1206 250 mW)
R7  RC0805FR-075K49L  [RESC2012X60N]
R8  RC0805FR-075K49L  [RESC2012X60N]
R9  value 10k  [RESC3216X60X45ML15T20]  (hidden comment: Resistor 10k +/-1% 1206 250 mW)
R10  value 10k  [RESC3216X60X45ML15T20]  (hidden comment: Resistor 10k +/-1% 1206 250 mW)
R11  RC0805FR-075K49L  [RESC2012X60N]
R12  RC0805FR-075K49L  [RESC2012X60N]

### Ports
M1_Current (out), M1_OUT+, M1_OUT-, M1_PWM1 (in), M1_PWM2 (in), M1_Sleep (in), M2_Current (out), M2_OUT+, M2_OUT-, M2_PWM1 (in), M2_PWM2 (in), M2_Sleep (in), M3_Current (out), M3_OUT+, M3_OUT-, M3_PWM1 (in), M3_PWM2 (in), M3_Sleep (in), M4_Current (out), M4_OUT+, M4_OUT-, M4_PWM1 (in), M4_PWM2 (in), M4_Sleep (in), M5_Current (out), M5_OUT+, M5_OUT-, M5_PWM1 (in), M5_PWM2 (in), M5_Sleep (in)

### Nets
3.3V: R1.2 R2.2 R5.2 R6.2 R9.2 R10.2
12V: C12.1 C13.2 C14.2 C17.1 C18.1 C19.2 C20.2 C21.2 C22.2 C25.1 C26.1 C27.2 C28.2 C29.2 C30.2 IC5.11(VM) IC6.11(VM) IC7.11(VM) IC8.11(VM) IC9.11(VM)
GND: C13.1 C14.1 C19.1 C20.1 C21.1 C22.1 C27.1 C28.1 C29.1 C30.1 IC5.7(IMODE) IC5.9(PGND) IC5.15(GND) IC5.16(PMODE) IC6.7(IMODE) IC6.9(PGND) IC6.15(GND) IC6.16(PMODE) IC7.7(IMODE) IC7.9(PGND) IC7.15(GND) IC7.16(PMODE) IC8.7(IMODE) IC8.9(PGND) IC8.15(GND) IC8.16(PMODE) IC9.7(IMODE) IC9.9(PGND) IC9.15(GND) IC9.16(PMODE) R3.1 R4.2 R7.2 R8.2 R11.2 R12.2
VREF: IC5.5(VREF) IC6.5(VREF) IC7.5(VREF) IC8.5(VREF) IC9.5(VREF) R1.1 R3.2
M1_Current: IC5.6(IPROPI) R4.1 ; port M1_Current
M1_OUT+: IC5.8(OUT1) ; port M1_OUT+
M1_OUT-: IC5.10(OUT2) ; port M1_OUT-
M1_PWM1: IC5.1(EN/IN1) ; port M1_PWM1
M1_PWM2: IC5.2(PH/IN2) ; port M1_PWM2
M1_Sleep: IC5.3(NSLEEP) ; port M1_Sleep
M2_Current: IC6.6(IPROPI) R7.1 ; port M2_Current
M2_OUT+: IC6.8(OUT1) ; port M2_OUT+
M2_OUT-: IC6.10(OUT2) ; port M2_OUT-
M2_PWM1: IC6.1(EN/IN1) ; port M2_PWM1
M2_PWM2: IC6.2(PH/IN2) ; port M2_PWM2
M2_Sleep: IC6.3(NSLEEP) ; port M2_Sleep
M3_Current: IC7.6(IPROPI) R8.1 ; port M3_Current
M3_OUT+: IC7.8(OUT1) ; port M3_OUT+
M3_OUT-: IC7.10(OUT2) ; port M3_OUT-
M3_PWM1: IC7.1(EN/IN1) ; port M3_PWM1
M3_PWM2: IC7.2(PH/IN2) ; port M3_PWM2
M3_Sleep: IC7.3(NSLEEP) ; port M3_Sleep
M4_Current: IC8.6(IPROPI) R11.1 ; port M4_Current
M4_OUT+: IC8.8(OUT1) ; port M4_OUT+
M4_OUT-: IC8.10(OUT2) ; port M4_OUT-
M4_PWM1: IC8.1(EN/IN1) ; port M4_PWM1
M4_PWM2: IC8.2(PH/IN2) ; port M4_PWM2
M4_Sleep: IC8.3(NSLEEP) ; port M4_Sleep
M5_Current: IC9.6(IPROPI) R12.1 ; port M5_Current
M5_OUT+: IC9.8(OUT1) ; port M5_OUT+
M5_OUT-: IC9.10(OUT2) ; port M5_OUT-
M5_PWM1: IC9.1(EN/IN1) ; port M5_PWM1
M5_PWM2: IC9.2(PH/IN2) ; port M5_PWM2
M5_Sleep: IC9.3(NSLEEP) ; port M5_Sleep
NetC11_1: C11.1 IC5.14(CPL)
NetC11_2: C11.2 IC5.13(CPH)
NetC12_2: C12.2 IC5.12(VCP)
NetC15_1: C15.1 IC6.14(CPL)
NetC15_2: C15.2 IC6.13(CPH)
NetC16_1: C16.1 IC7.14(CPL)
NetC16_2: C16.2 IC7.13(CPH)
NetC17_2: C17.2 IC6.12(VCP)
NetC18_2: C18.2 IC7.12(VCP)
NetC23_1: C23.1 IC8.14(CPL)
NetC23_2: C23.2 IC8.13(CPH)
NetC24_1: C24.1 IC9.14(CPL)
NetC24_2: C24.2 IC9.13(CPH)
NetC25_2: C25.2 IC8.12(VCP)
NetC26_2: C26.2 IC9.12(VCP)
NetIC5_4: IC5.4(NFAULT) R2.1
NetIC6_4: IC6.4(NFAULT) R5.1
NetIC7_4: IC7.4(NFAULT) R6.1
NetIC8_4: IC8.4(NFAULT) R9.1
NetIC9_4: IC9.4(NFAULT) R10.1

Not connected (* = marked no-connect by the designer): IC5 17(EP); IC6 17(EP); IC7 17(EP); IC8 17(EP); IC9 17(EP)

### Notes on the sheet
- DWG. NO.
- REV.
- SHT.
- THIS DOCUMENT AND THE DATA DISCLOSED HEREIN OR HEREWITH IS THE PROPERTY OF ALTIUM LIMITED AND MAY BE FREELY DISTRIBUTED IN WHOLE. NO RIGHTS ARE RESERVED OR EXPRESS OR IMPLIED WARANTEE GIVEN.
- REVISION
- DESCRIPTION
- DATE
- APPROVED
- ENG:
- APPROVALS
- PROJECT
- DSN:
- CHK:
- REFERENCE DOCUMENTS
- PROJECT REVISION:
- TITLE
- DOCUMENT REVISION:
- DESIGN ITEM:
- BOM:
- FAB DWG:
- PCB DWG:
- ASSY DWG:
- SCALE:
- SIZE
- B
- CAGE CODE
- FILE NAME
- DWG NO.
- SHEET
- OF
- REV

### Library data of the parts
C11 C15 C16 C23 C24 = CMP-001-00062-3: Chip Capacitor, 22nF +/-20%, 10V, 0402, Thickness 0.6 mm; Tolerance: 10%; Min Operating Temperature: -55°C; Case/Package: 0402; Pins: 2; Max Operating Temperature: 85°C; Mounting Technology: SMT; Voltage Rating: 10V
C12 C13 C17-C19 C21 C25-C27 C29 = CMP-001-00018-6: as C?#4 on sheet Controller; Pins: 2; Max Operating Temperature: 125°C; Min Operating Temperature: -55°C; Mounting Technology: SM; Case/Package: 0805; RoHS Compliant: True; Tolerance: 10%
C14 C20 C22 C28 C30 = CMP-001-00079-4: Chip Capacitor, 10µF +/-20%, 25V, 0805, Thickness 1.45 mm; Tolerance: 10%; Max Operating Temperature: 85°C; Case/Package: 0805; Voltage Rating: 25V; Min Operating Temperature: -55°C; Mounting Technology: SMT; Pins: 2
IC5-IC9 = DRV8874PWPR: Integrated Circuit; Manufacturer_Name: Texas Instruments; Datasheet Link: https://www.ti.com/lit/gpn/DRV8874; Height: 1.2mm; Manufacturer_Part_Number: DRV8874PWPR; Mouser Part Number: 595-DRV8874PWPR; Mouser Price/Stock: https://www.mouser.co.uk/ProductDetail/Texas-Instruments/DRV8874PWPR?qs=mAH9sUMRCtvh%2FSU15ywmDA%3D%3D; Arrow Part Number: DRV8874PWPR; Arrow Price/Stock: https://www.arrow.com/en/products/drv8874pwpr/texas-instruments?region=europe
R1 = RC0805FR-0716KL: Resistor; Manufacturer_Name: YAGEO; Datasheet Link: https://www.yageo.com/upload/media/product/productsearch/datasheet/rchip/PYu-RC_Group_51_RoHS_L_11.pdf; Height: 0.6mm; Manufacturer_Part_Number: RC0805FR-0716KL
R2 R5 R6 R9 R10 = CMP-009-00016-5: as R?#1 on sheet Controller; Pins: 2; Max Operating Temperature: 155°C; Tolerance: 1%; RoHS Compliant: True; Case/Package: 1206; Min Operating Temperature: -55°C; Mounting Technology: SM
R3 = RC0805FR-0751KL: Resistor; Manufacturer_Name: KEMET; Datasheet Link: http://www.yageo.com/documents/recent/PYu-RC_Group_51_RoHS_L_10.pdf; Height: 0.6mm; Manufacturer_Part_Number: RC0805FR-0751KL; Mouser Part Number: 603-RC0805FR-0751KL; Mouser Price/Stock: https://www.mouser.com/Search/Refine.aspx?Keyword=603-RC0805FR-0751KL
R4 R7 R8 R11 R12 = RC0805FR-075K49L: Resistor; Manufacturer_Name: KEMET; Datasheet Link: http://www.yageo.com/documents/recent/PYu-RC_Group_51_RoHS_L_10.pdf; Height: 0.6mm; Manufacturer_Part_Number: RC0805FR-075K49L; Mouser Part Number: 603-RC0805FR-075K49L; Mouser Price/Stock: https://www.mouser.co.uk/ProductDetail/Yageo/RC0805FR-075K49L?qs=VLOqbHBAO5cAd3YpTUoSOQ%3D%3D; Arrow Part Number: RC0805FR-075K49L; Arrow Price/Stock: https://www.arrow.com/en/products/rc0805fr-075k49l/yageo

## Sheet Block Diagram.SchDoc
size A3; Organization: My Company; Address1: Address Line 1; Address2: Address Line 2; Address3: Address Line 3; Address4: Address Line 4; SheetNumber: 5; SheetTotal: 5
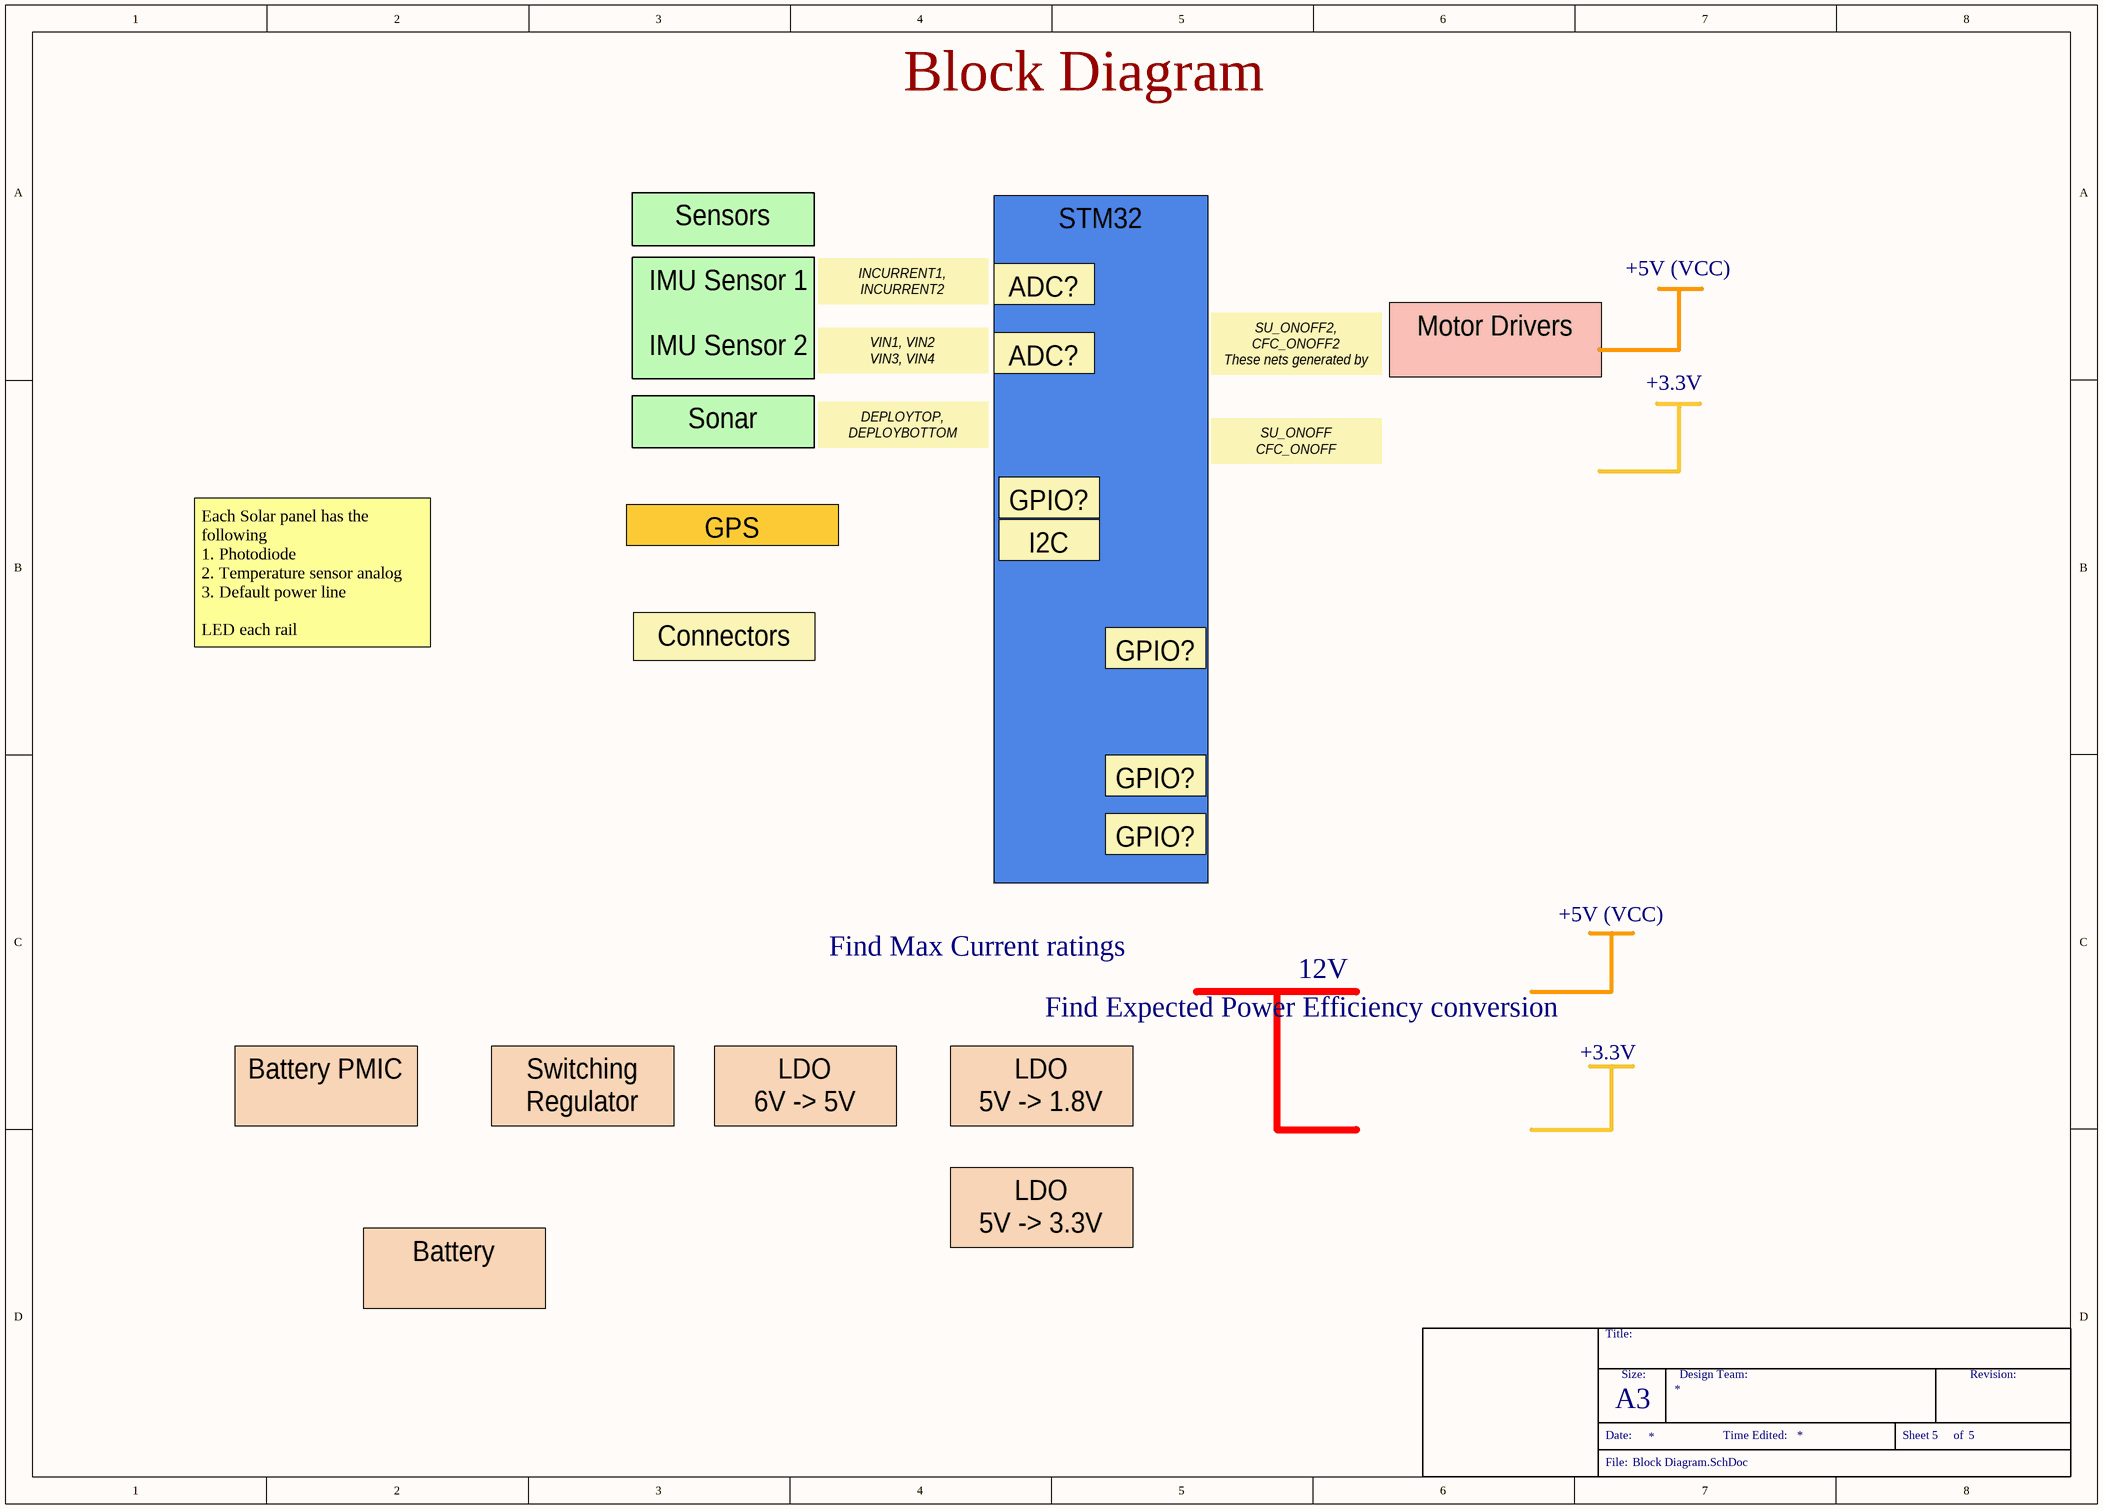
[diagram p6: Block Diagram.SchDoc]

### Notes on the sheet
- Block Diagram
- Sensors
- INCURRENT1, INCURRENT2
  INCURRENT3, INCURRENT4
- ADC?
- +5V (VCC)
- IMU Sensor 1
  IMU Sensor 2
- VIN1, VIN2
  VIN3, VIN4
- SU_ONOFF2, CFC_ONOFF2
  These nets generated by 3.3V MOSFETS, not STM32
- Motor Drivers
- Sonar
- DEPLOYTOP, DEPLOYBOTTOM
  DEPLOYRIGHT, DEPLOYLEFT
- +3.3V
- GPIO?
- SU_ONOFF
  CFC_ONOFF
- GPS
- I2C
- Each Solar panel has the following
  1. Photodiode
  2. Temperature sensor analog
  3. Default power line
  LED each rail
- Connectors
- STM32
- Find Max Current ratings
- 12V
- Find Expected Power Efficiency conversion
- Battery PMIC
- Switching Regulator
- LDO
  6V -> 5V
- LDO
  5V -> 1.8V
- LDO
  5V -> 3.3V
- Battery
- Title:
- Size:
- Design Team:
- Revision:
- Date:
- A3
- Time Edited:
- Sheet
- of
- File:

## Nets that join several sheets
3.3V: IMU_sensors (5 pins), Motor_Drivers (6 pins)
5V: connectors(temp) (5 pins), Controller (21 pins)
GND: connectors(temp) (7 pins), IMU_sensors (10 pins), Controller (25 pins), Motor_Drivers (36 pins)
M1_Current: Controller (U?#4.58), Motor_Drivers (IC5.6 R4.1)
M1_OUT+: connectors(temp) (J1.1), Motor_Drivers (IC5.8)
M1_OUT-: connectors(temp) (J1.2), Motor_Drivers (IC5.10)
M1_PWM1: Controller (U?#2.87), Motor_Drivers (IC5.1)
M1_PWM2: Controller (U?#2.88), Motor_Drivers (IC5.2)
M1_Sleep: Controller (U?#2.86), Motor_Drivers (IC5.3)
M2_Current: Controller (U?#4.21), Motor_Drivers (IC6.6 R7.1)
M2_OUT+: connectors(temp) (J2.1), Motor_Drivers (IC6.8)
M2_OUT-: connectors(temp) (J2.2), Motor_Drivers (IC6.10)
M2_PWM1: Controller (U?#4.4), Motor_Drivers (IC6.1)
M2_PWM2: Controller (U?#4.5), Motor_Drivers (IC6.2)
M2_Sleep: Controller (U?#4.2), Motor_Drivers (IC6.3)
M3_A: connectors(temp) (J6.5), Controller (U?#2.51)
M3_B: connectors(temp) (J6.6), Controller (U?#2.52)
M3_Current: Controller (U?#2.53), Motor_Drivers (IC7.6 R8.1)
M3_OUT+: connectors(temp) (J6.1), Motor_Drivers (IC7.8)
M3_OUT-: connectors(temp) (J6.2), Motor_Drivers (IC7.10)
M3_PWM1: Controller (U?#2.55), Motor_Drivers (IC7.1)
M3_PWM2: Controller (U?#2.56), Motor_Drivers (IC7.2)
M3_Sleep: Controller (U?#2.57), Motor_Drivers (IC7.3)
M4_A: connectors(temp) (J7.5), Controller (U?#2.95)
M4_B: connectors(temp) (J7.6), Controller (U?#2.96)
M4_Current: Controller (U?#4.60), Motor_Drivers (IC8.6 R11.1)
M4_OUT+: connectors(temp) (J7.1), Motor_Drivers (IC8.8)
M4_OUT-: connectors(temp) (J7.2), Motor_Drivers (IC8.10)
M4_PWM1: Controller (U?#2.97), Motor_Drivers (IC8.1)
M4_PWM2: Controller (U?#2.98), Motor_Drivers (IC8.2)
M4_Sleep: Controller (U?#2.91), Motor_Drivers (IC8.3)
M5_A: connectors(temp) (J9.5), Controller (U?#2.41)
M5_B: connectors(temp) (J9.6), Controller (U?#2.42)
M5_Current: Controller (U?#2.37), Motor_Drivers (IC9.6 R12.1)
M5_OUT+: connectors(temp) (J9.1), Motor_Drivers (IC9.8)
M5_OUT-: connectors(temp) (J9.2), Motor_Drivers (IC9.10)
M5_PWM1: Controller (U?#2.43), Motor_Drivers (IC9.1)
M5_PWM2: Controller (U?#2.46), Motor_Drivers (IC9.2)
M5_Sleep: Controller (U?#2.35), Motor_Drivers (IC9.3)